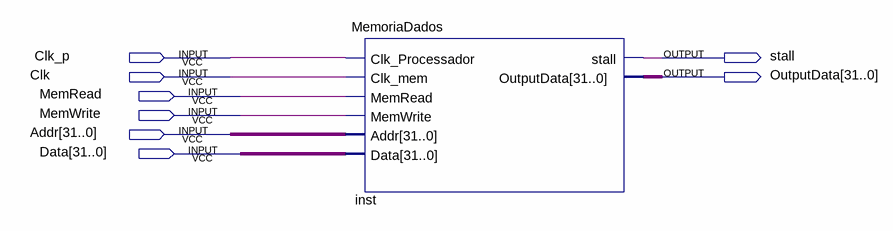
[diagram p0: schematic sheet]
// Quartus schematic MemoriaDadosFinal.bdf as structural Verilog: 1 symbols, 8 pins
module MemoriaDadosFinal (
  input  Clk_p,
  input  Clk,
  input  MemRead,
  input  MemWrite,
  input  [31:0] Addr,
  input  [31:0] Data,
  output stall,
  output [31:0] OutputData
);

  MemoriaDados inst (
    .Clk_Processador(Clk_p), .Clk_mem(Clk), .MemRead(MemRead), .MemWrite(MemWrite), .Addr(Addr), .Data(Data),
    .stall(stall), .OutputData(OutputData));
endmodule
